# Altium schematic sheet BLDC_Drive.SchDoc
size A3; SheetNumber: 1; SheetTotal: 3
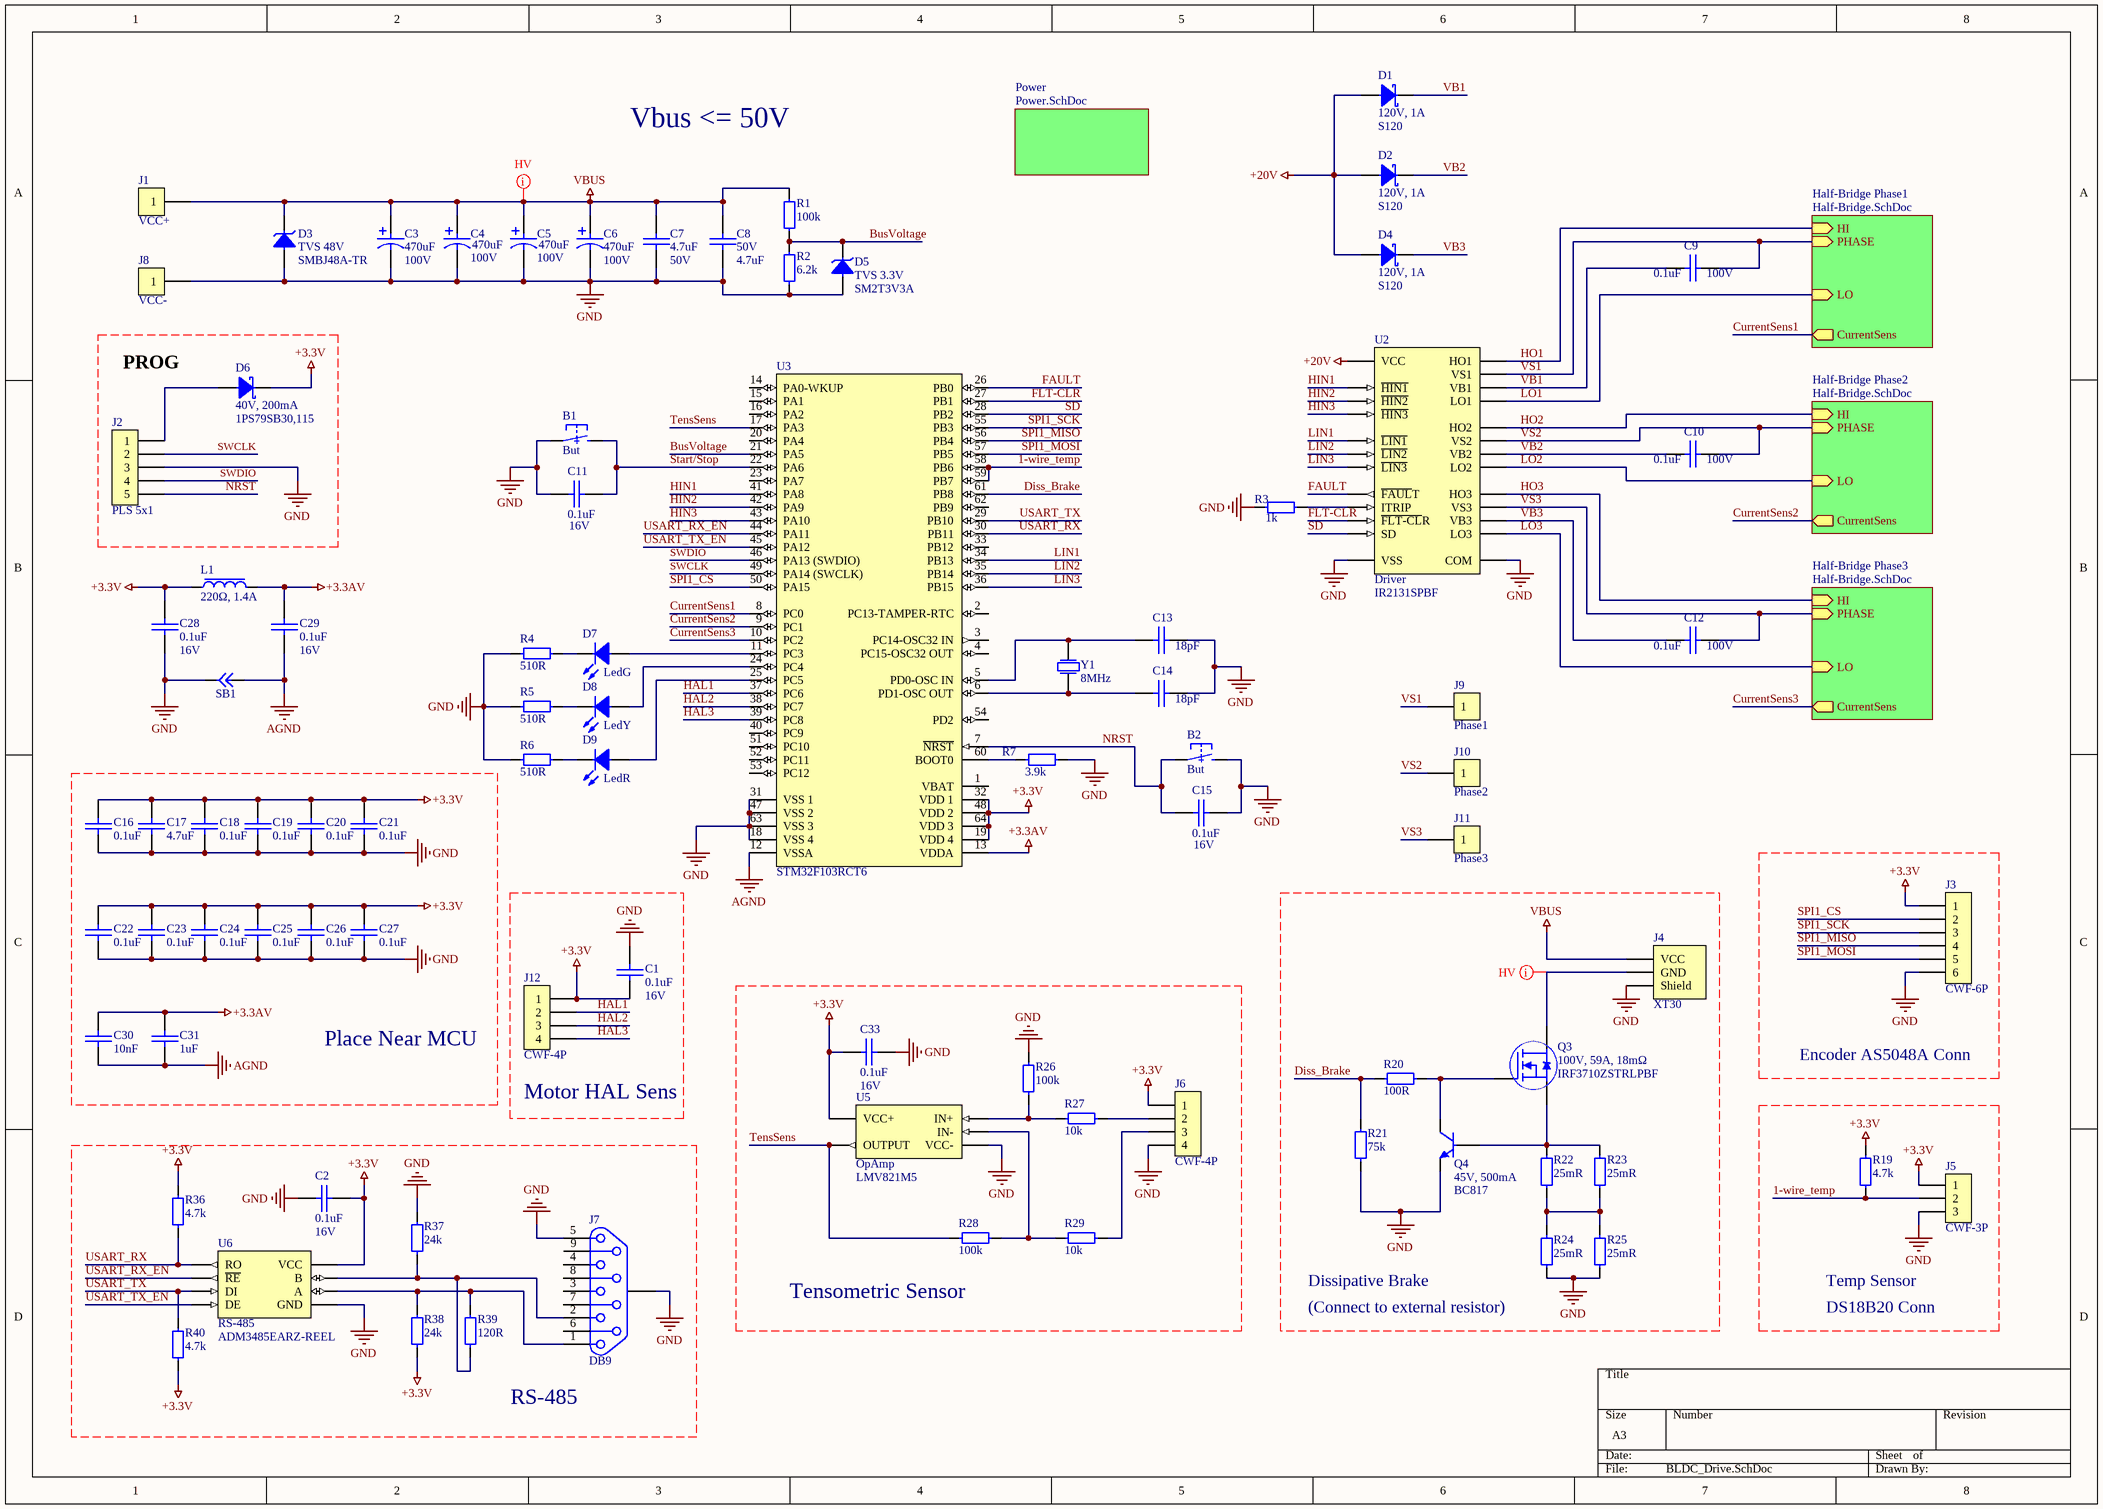
[diagram p0: BLDC_Drive.SchDoc]

## Parts
B1  But  [BUTTON 6x3.5]
B2  But  [BUTTON 6x3.5]
C1  0.1uF  Voltage: 16V  [0603 Capicator]
C2  0.1uF  Voltage: 16V  [0603 Capicator]
C3  470uF  Voltage: 100V  [ECAP 16x25mm]
C4  470uF  Voltage: 100V  [ECAP 16x25mm]
C5  470uF  Voltage: 100V  [ECAP 16x25mm]
C6  470uF  Voltage: 100V  [ECAP 16x25mm]
C7  4.7uF  Voltage: 50V  [1206 Capacitor]
C8  4.7uF  Voltage: 50V  [1206 Capacitor]
C9  0.1uF  Voltage: 100V  [1206 Capacitor]
C10  0.1uF  Voltage: 100V  [1206 Capacitor]
C11  0.1uF  Voltage: 16V  [0603 Capicator]
C12  0.1uF  Voltage: 100V  [1206 Capacitor]
C13  18pF  [0603 Capicator]
C14  18pF  [0603 Capicator]
C15  0.1uF  Voltage: 16V  [0603 Capicator]
C16  0.1uF  [0603 Capicator]
C17  4.7uF  [0603 Capicator]
C18  0.1uF  [0603 Capicator]
C19  0.1uF  [0603 Capicator]
C20  0.1uF  [0603 Capicator]
C21  0.1uF  [0603 Capicator]
C22  0.1uF  [0603 Capicator]
C23  0.1uF  [0603 Capicator]
C24  0.1uF  [0603 Capicator]
C25  0.1uF  [0603 Capicator]
C26  0.1uF  [0603 Capicator]
C27  0.1uF  [0603 Capicator]
C28  0.1uF  Voltage: 16V  [0603 Capicator]
C29  0.1uF  Voltage: 16V  [0603 Capicator]
C30  10nF  [0603 Capicator]
C31  1uF  [0603 Capicator]
C33  0.1uF  Voltage: 16V  [0603 Capicator]
D1  120V, 1A  Part Number: S120  [SOD-123FL]
D2  120V, 1A  Part Number: S120  [SOD-123FL]
D3  TVS 48V  Part Number: SMBJ48A-TR  [SMB]
D4  120V, 1A  Part Number: S120  [SOD-123FL]
D5  TVS 3.3V  Part Number: SM2T3V3A  [DO-216AA]
D6  40V, 200mA  Part Number: 1PS79SB30,115  [SOD-523]
D7  LedG  [0805 LED]
D8  LedY  [0805 LED]
D9  LedR  [0805 LED]
J1  VCC+  [Cable25]
J2  PLS 5x1  [PLS 5x1]
J3  CWF-6P  [Conn6x1]
J4  XT30  [HEADER 2 XT30PW Male]
J5  CWF-3P  [Conn3x1]
J6  CWF-4P  [Conn4x1]
J7  DB9  [DB9]
J8  VCC-  [Cable25]
J9  Phase1  [Cable25]
J10  Phase2  [Cable25]
J11  Phase3  [Cable25]
J12  CWF-4P  [Conn4x1]
L1  220Ω, 1.4A  [0603 Inductor]
Q3  100V, 59A, 18mΩ  Part Number: IRF3710ZSTRLPBF  [D2-PAK (TO-262)]
Q4  45V, 500mA  Part Number: BC817  [SOT-23]
R1  100k  [0603 Resistor]
R2  6.2k  [0603 Resistor]
R3  1k  [0603 Resistor]
R4  510R  [0603 Resistor]
R5  510R  [0603 Resistor]
R6  510R  [0603 Resistor]
R7  3.9k  [0603 Resistor]
R19  4.7k  [0603 Resistor]
R20  100R  [0603 Resistor]
R21  75k  [0603 Resistor]
R22  25mR  [2512 Resistor]
R23  25mR  [2512 Resistor]
R24  25mR  [2512 Resistor]
R25  25mR  [2512 Resistor]
R26  100k  [0603 Resistor]
R27  10k  [0603 Resistor]
R28  100k  [0603 Resistor]
R29  10k  [0603 Resistor]
R36  4.7k  [0603 Resistor]
R37  24k  [0603 Resistor]
R38  24k  [0603 Resistor]
R39  120R  [0603 Resistor]
R40  4.7k  [0603 Resistor]
SB1  Circuit Breaker  [SB 0603]  (value not drawn)
U2  Driver  Part Number: IR2131SPBF  [SOIC-28 Wide]
U3  STM32F103RCT6  [LQFP64]
U5  OpAmp  Part Number: LMV821M5  [SOT-23-5]
U6  RS-485  Part Number: ADM3485EARZ-REEL  [SOIC-8]
Y1  8MHz  [hc-49sm]

## Sub-sheets
Half-Bridge Phase1 = Half-Bridge.SchDoc: LO (in), HI (in), CurrentSens (out), PHASE (in)
Half-Bridge Phase2 = Half-Bridge.SchDoc: LO (in), HI (in), CurrentSens (out), PHASE (in)
Half-Bridge Phase3 = Half-Bridge.SchDoc: LO (in), HI (in), CurrentSens (out), PHASE (in)
Power = Power.SchDoc: no entries

## Nets
+3.3AV: C29.2 C30.2 C31.2 L1.2 U3.13(VDDA)
+3.3V: C1.1 C2.2 C16.2 C17.2 C18.2 C19.1 C20.2 C21.1 C22.2 C23.2 C24.2 C25.2 C26.2 C27.2 C28.2 C33.1 D6.2 J3.1 J5.1 J6.1 J12.1 L1.1 R19.2 R36.2 R38.1 R40.1 U3.19(VDD_4) U3.32(VDD_1) U3.48(VDD_2) U3.64(VDD_3) U5.5(VCC+) U6.8(VCC)
+20V: D1.1 D2.1 D4.1 U2.1(VCC)
AGND: C29.1 C30.1 C31.1 SB1.2 U3.12(VSSA)
GND: B1.1 B2.2 C1.2 C2.1 C3.1 C4.1 C5.1 C6.1 C7.1 C8.1 C11.1 C13.2 C14.2 C15.2 C16.1 C17.1 C18.1 C19.2 C20.1 C21.2 C22.1 C23.1 C24.1 C25.1 C26.1 C27.1 C28.1 C33.2 D3.1 D5.1 J2.3 J3.6 J4.A(Shield) J5.3 J6.4 J7.5 J7.A J8.1 Q4.2 R2.1 R3.1 R4.1 R5.1 R6.1 R7.2 R21.1 R24.1 R25.1 R26.1 R37.2 SB1.1 U2.12(VSS) U2.13(COM) U3.18(VSS_4) U3.31(VSS_1) U3.47(VSS_2) U3.63(VSS_3) U5.2(VCC-) U6.5(GND)
VBUS: C3.2 C4.2 C5.2 C6.2 C7.2 C8.2 D3.2 J1.1 J4.1(VCC) R1.2
1-wire_temp: J5.2 R19.1 U3.58(PB6) U3.59(PB7)
BusVoltage: D5.2 R1.1 R2.2 U3.21(PA5)
CurrentSens1: U3.8(PC0) ; sheet Half-Bridge Phase1/CurrentSens
CurrentSens2: U3.9(PC1) ; sheet Half-Bridge Phase2/CurrentSens
CurrentSens3: U3.10(PC2) ; sheet Half-Bridge Phase3/CurrentSens
Diss_Brake: R20.1 R21.2 U3.61(PB8)
FAULT: U2.8(~{FAUL}T) U3.26(PB0)
FLT-CLR: U2.10(~{FLT-CL}R) U3.27(PB1)
HAL1: J12.2 U3.37(PC6)
HAL2: J12.3 U3.38(PC7)
HAL3: J12.4 U3.39(PC8)
HIN1: U2.2(~{HIN1}) U3.41(PA8)
HIN2: U2.3(~{HIN2}) U3.42(PA9)
HIN3: U2.4(~{HIN3}) U3.43(PA10)
HO1: U2.27(HO1) ; sheet Half-Bridge Phase1/HI
HO2: U2.23(HO2) ; sheet Half-Bridge Phase2/HI
HO3: U2.19(HO3) ; sheet Half-Bridge Phase3/HI
LIN1: U2.5(~{LIN1}) U3.34(PB13)
LIN2: U2.6(~{LIN2}) U3.35(PB14)
LIN3: U2.7(~{LIN3}) U3.36(PB15)
LO1: U2.16(LO1) ; sheet Half-Bridge Phase1/LO
LO2: U2.15(LO2) ; sheet Half-Bridge Phase2/LO
LO3: U2.14(LO3) ; sheet Half-Bridge Phase3/LO
NRST: B2.1 C15.1 J2.5 U3.7(~{NRST})
SD: U2.11(SD) U3.28(PB2)
SPI1_CS: J3.2 U3.50(PA15)
SPI1_MISO: J3.4 U3.56(PB4)
SPI1_MOSI: J3.5 U3.57(PB5)
SPI1_SCK: J3.3 U3.55(PB3)
Start/Stop: B1.2 C11.2 U3.22(PA6)
SWCLK: J2.2 U3.49(PA14_(SWCLK))
SWDIO: J2.4 U3.46(PA13_(SWDIO))
TensSens: R28.2 U3.17(PA3) U5.4(OUTPUT)
USART_RX: R36.1 U3.30(PB11) U6.1(RO)
USART_RX_EN: U3.44(PA11) U6.2(~{RE})
USART_TX: R40.2 U3.29(PB10) U6.4(DI)
USART_TX_EN: U3.45(PA12) U6.3(DE)
VB1: C9.2 D1.2 U2.28(VB1)
VB2: C10.2 D2.2 U2.24(VB2)
VB3: C12.2 D4.2 U2.20(VB3)
VS1: C9.1 J9.1 U2.26(VS1) ; sheet Half-Bridge Phase1/PHASE
VS2: C10.1 J10.1 U2.22(VS2) ; sheet Half-Bridge Phase2/PHASE
VS3: C12.1 J11.1 U2.18(VS3) ; sheet Half-Bridge Phase3/PHASE
NetC13_1: C13.1 U3.5(PD0-OSC_IN) Y1.2
NetC14_1: C14.1 U3.6(PD1-OSC_OUT) Y1.1
NetD6_1: D6.1 J2.1
NetD7_1: D7.1 U3.11(PC3)
NetD7_2: D7.2 R4.2
NetD8_1: D8.1 U3.24(PC4)
NetD8_2: D8.2 R5.2
NetD9_1: D9.1 U3.25(PC5)
NetD9_2: D9.2 R6.2
NetJ4_2: J4.2(GND) Q3.2(Drain)
NetJ6_2: J6.2 R27.2
NetJ6_3: J6.3 R29.2
NetJ7_1: J7.1 R38.2 R39.2 U6.6(A)
NetJ7_2: J7.2 R37.1 R39.1 U6.7(B)
NetQ3_1: Q3.1(Gate) Q4.3 R20.2
NetQ3_3: Q3.3(Source) Q4.1 R22.2 R23.2
NetR3_2: R3.2 U2.9(ITRIP)
NetR7_1: R7.1 U3.60(BOOT0)
NetR22_1: R22.1 R23.1 R24.2 R25.2
NetR26_2: R26.2 R27.1 U5.1(IN+)
NetR28_1: R28.1 R29.1 U5.3(IN-)

Not connected (* = marked no-connect by the designer): J7 3 4 6 7 8 9; U3 1(VBAT) 2(PC13-TAMPER-RTC) 3(PC14-OSC32_IN) 4(PC15-OSC32_OUT) 14(PA0-WKUP) 15(PA1) 16(PA2) 20(PA4) 23(PA7) 33(PB12) 40(PC9) 51(PC10) 52(PC11) 53(PC12) 54(PD2) 62(PB9)

## Layout directives
net class HV: NetJ4_2, VBUS

## Notes on the sheet
- Vbus <= 50V
- PROG
- Place Near MCU
- (near J12) Motor HAL Sens
- Encoder AS5048A Conn
- (near R28) Tensometric Sensor
- Dissipative Brake
- (Connect to external resistor)
- Temp Sensor
- DS18B20 Conn
- RS-485

## Library data of the parts
B1 B2 = Button 2 Conn: Button 2 Conn SMD; Part Number: L-KLS7-TS3608-5.0-180; Manufacturer: KLS electronic co ltd; Type: Button; ComponentLink1Description: Chip&Dip; ComponentLink1URL: https://www.chipdip.ru/product/kls7-ts3608-5.0-180-td-02xa
C1 C2 C11 C15 C16 C18-C29 C33 = Cap 0.1uF (0603): 0.1uF X7R 16V 10% 0603; Manufacturer: Murata Manufacturing; Part Number: GRM188R71C104KA01D; Type: Capacitor; ComponentLink1Description: Chip&Dip; ComponentLink1URL: https://www.chipdip.ru/product/grm188r71c104ka01d
  C16 C18-C27: Voltage: 16V
C3-C6 = Cap Pol 470uF (100V): ECAP, 100V, 105°C, 20%, 8x16mm; Part Number: JRB2A471M07501600250000B; Manufacturer: JB; Type: Capacitor; ComponentLink1Description: Chip&Dip; ComponentLink1URL: https://www.chipdip.ru/product0/9000565913
C7 C8 = Cap 4.7uF (1206): 4.7uF X7R 10% 50V 1206; Manufacturer: Murata Manufacturing; Part Number: GRM31CR71H475KA12L; Type: Capacitor; ComponentLink1Description: Chip&Dip; ComponentLink1URL: https://www.chipdip.ru/product/grm31cr71h475ka12l
C9 C10 C12 = Cap 0.1uF (1206): 0.1uF X7R 100V 10% 1206; Manufacturer: Murata Manufacturing; Part Number: GRM319R72A104KA01D; Type: Capacitor; ComponentLink1Description: Chip&Dip; ComponentLink1URL: https://www.chipdip.ru/product0/9000697437
C13 C14 = Cap 18pF (0603): 18pF NP0 50V 5% 0603; Manufacturer: Murata Manufacturing; Part Number: GRM1885C1H180JA01D; Type: Capacitor; ComponentLink1Description: Chip&Dip; ComponentLink1URL: https://www.chipdip.ru/product/grm1885c1h180j; Voltage: 50V
C17 = Cap 4.7uF (0603): 4.7uF X5R 25V 10% 0603; Manufacturer: Murata Manufacturing; Part Number: GRM188R61E475KE11D; Type: Capacitor; ComponentLink1Description: Chip&Dip; ComponentLink1URL: https://www.chipdip.ru/product0/9000348448; Voltage: 25V
C30 = Cap 10nF (0603): X7R 10nF 100V 10% 0603; Manufacturer: Murata Manufacturing; Part Number: GRM188R72A103KA01D; Type: Capacitor; ComponentLink1Description: Chip&Dip; ComponentLink1URL: https://www.chipdip.ru/product/grm188r72a103ka01d; Voltage: 100V
C31 = Cap 1uF (0603): 1uF X5R 25V 10% 0603; Manufacturer: Murata Manufacturing; Part Number: GRM188R61E105KAADD; Type: Capacitor; ComponentLink1Description: Chip&Dip; ComponentLink1URL: https://www.chipdip.ru/product/grm188r61e105k; Voltage: 25V
D1 D2 D4 = Diode Schottky 120V (SOD-123FL): Manufacturer: Yangzhou Yangjie Electronic Technology Co; Type: Diode; ComponentLink1Description: DataSheet; ComponentLink1URL: https://static.chipdip.ru/lib/152/DOC001152954.pdf; ComponentLink2Description: Chip&Dip; ComponentLink2URL: https://www.chipdip.ru/product/s120
D3 = TVS Diode 48V [SMBJ]: 600W; Manufacturer: STMicroelectronics; Type: Diode; ComponentLink1Description: DataSheet; ComponentLink1URL: https://static.chipdip.ru/lib/252/DOC011252020.pdf; ComponentLink2Description: Chip&Dip; ComponentLink2URL: https://www.chipdip.ru/product/smbj48a
D5 = TVS Diode 3.3V [SM2T]: High peak pulse power: 200 W (10/1000 μs); Manufacturer: STMicroelectronics; Type: Diode; ComponentLink1Description: DataSheet; ComponentLink1URL: https://www.st.com/resource/en/datasheet/sm2t3v3a.pdf; ComponentLink2Description: Chip&Dip; ComponentLink2URL: https://www.chipdip.ru/product0/8283670575
D6 = Diode Schottky (SOD-523): Schottky Barrier Diodes, 200mA to 500mA; Manufacturer: Nexperia; Type: Diode; ComponentLink1Description: DataSheet; ComponentLink1URL: https://static.chipdip.ru/lib/583/DOC001583065.pdf; ComponentLink2Description: Chip&Dip; ComponentLink2URL: https://www.chipdip.ru/product/1ps79sb30.115
D7 = Led Green: Led Green SMD 1608, 120°, 525nM; Part Number: TO-1608BC-PG; Manufacturer: Taiwan Oasis Technology; Type: Diode; ComponentLink1Description: Chip&Dip; ComponentLink1URL: https://www.chipdip.ru/product/to-1608bc-pg
D8 = Led Yellow: SMD 1608, 247mcd, 120°, 592nM (High Bright Yellow); Part Number: TO-1608BC-MYF; Manufacturer: Taiwan Oasis Technology; Type: Diode; ComponentLink1Description: Chip&Dip; ComponentLink1URL: https://www.chipdip.ru/product/to-1608bc-myf
D9 = Led Red: SMD 1608, 112mcd, 120°, 630nM (Ultra Bright Red); Part Number: TO-1608BC-MRE; Manufacturer: Taiwan Oasis Technology; Type: Diode; ComponentLink1Description: Chip&Dip; ComponentLink1URL: https://www.chipdip.ru/product/to-1608bc-mre
J1 J8-J11 = Conn 1 [Cable]
J2 = Conn 5 (PLS): Header, 5-Pin
J3 = Conn 6 [CWF]: Right-Angle; Manufacturer: Ningbo connfly electronic (Zhenqin); Part Number: DS1069-6MRW6X-B; Type: Connector; ComponentLink1Description: Chip&Dip; ComponentLink1URL: https://www.chipdip.ru/product/cwf-6r
J4 = Connector XT30PW-Male: Standart RC Connector; Part Number: XT30PW; Manufacturer: Amass; ComponentLink1Description: AliExpress; ComponentLink1URL: https://ru.aliexpress.com/item/4000070113352.html?spm=a2g0o.productlist.0.0.39dd34bfyYuspa&algo_pvid=4d7d83f5-6270-4220-b100-9b5f13b0846d&algo_expid=4d7d83f5-6270-4220-b100-9b5f13b0846d-3&btsid=c67bc929-e3be-4af3-9fd9-25ac13ce4818&ws_ab_test=searchweb0_0,searchweb201602_,searchweb201603_55; Type: Connector
J5 = Conn 3 [CWF]: Right-Angle; Manufacturer: Ningbo connfly electronic (Zhenqin); Part Number: DS1069-3MRW6SA; Type: Connector; ComponentLink1Description: Chip&Dip; ComponentLink1URL: https://www.chipdip.ru/product/cwf-3r
J6 J12 = Conn 4 [CWF]: Right-Angle; Part Number: DS1069-4MRW6XB; Manufacturer: Ningbo connfly electronic (Zhenqin); Type: Connector; ComponentLink1Description: Chip&Dip; ComponentLink1URL: https://www.chipdip.ru/product/cwf-4r
J7 = Connector DB9: CONN D-SUB PLUG 9POS R/A SOLDER; Part Number: DR09S-H-CN; Manufacturer: Auk Contractors; ComponentLink1Description: DataSheet; ComponentLink1URL: https://static.chipdip.ru/lib/009/DOC004009535.pdf; ComponentLink2Description: Chip&Dip; ComponentLink2URL: https://www.chipdip.ru/product/dr09s-h-cn-drb-9fa-dbr-9f; Type: Connector
L1 = Ferrite Bead 220 (0603): Chip beads for power line. GHz noise countermeasure; Part Number: BLM18PG221SN1D; Manufacturer: Murata; Type: Inductor; ComponentLink1Description: DataSheet; ComponentLink1URL: https://product.tdk.com/en/system/files?file=dam/doc/product/emc/emc/beads/catalog/beads_commercial_power_mpz1005-e_en.pdf; ComponentLink2Description: Electronshik; ComponentLink2URL: https://www.electronshik.ru/item/MUR/BLM18PG221SN1D; ComponentLink3Description: Chip&Dip; ComponentLink3URL: https://www.chipdip.ru/product0/8007351955
Q3 = MOSFET-N [IRF]: Power MOSFET utilizes the latest processing techniques to achieve extremely low on-resistance per silicon area; Manufacturer: Infineon; Type: Transistor; ComponentLink1Description: DataSheet; ComponentLink1URL: https://static.chipdip.ru/lib/300/DOC000300442.pdf; ComponentLink2Description: Chip&Dip; ComponentLink2URL: https://www.chipdip.ru/product/irf3710zspbf
Q4 = NPN [BC817]: NPN general-purpose transistors; Manufacturer: Nexperia; Type: Transistor; ComponentLink1Description: DataSheet; ComponentLink1URL: https://static.chipdip.ru/lib/156/DOC000156781.pdf; ComponentLink2Description: Chip&Dip; ComponentLink2URL: https://www.chipdip.ru/product/bc817-40
R1 R26 R28 = Res 100k (0603): 0.1W 0603 100k, 1%; Part Number: RC0603FR-07100KL; Manufacturer: Taiwan; Type: Resistor; ComponentLink1Description: Chip&Dip; ComponentLink1URL: https://www.chipdip.ru/product0/9000079760
R2 = Res 6.2k (0603): 0.1W 0603 6.2k, 1%; Part Number: RC0603FR-076K2L; Manufacturer: Taiwan; Type: Resistor; ComponentLink1Description: Chip&Dip; ComponentLink1URL: https://www.chipdip.ru/product/0.1w-0603-6.2-kom-1
R3 = Res 1k (0603): 0.1W 0603 1k, 1%; Part Number: RC0603FR-071KL; Manufacturer: Taiwan; Type: Resistor; ComponentLink1Description: Chip&Dip; ComponentLink1URL: https://www.chipdip.ru/product0/9000079676
R4-R6 = Res 510R (0603): 0.1W 0603 510R, 1%; Part Number: RC0603FR-07510RL; Manufacturer: Taiwan; Type: Resistor; ComponentLink1Description: Chip&Dip; ComponentLink1URL: https://www.chipdip.ru/product0/9000079669
R7 = Res 3.9k (0603): 0.1W 0603 3.9k, 1%; Part Number: RC0603FR-073K9L; Manufacturer: Taiwan; Type: Resistor; ComponentLink1Description: Chip&Dip; ComponentLink1URL: https://www.chipdip.ru/product0/9000079726
R19 R36 R40 = Res 4.7k (0603): 0.1W 0603 4.7k, 1%; Part Number: RC0603FR-074K7L; Manufacturer: Taiwan; Type: Resistor; ComponentLink1Description: Chip&Dip; ComponentLink1URL: https://www.chipdip.ru/product0/9000079728
R20 = Res 100R (0603): 0.1W 0603 100R, 1%; Part Number: RC0603FR-07100RL; Manufacturer: Taiwan; Type: Resistor; ComponentLink1Description: Chip&Dip; ComponentLink1URL: https://www.chipdip.ru/product0/9000079616
R21 = Res 75k (0603): 0.1W 0603 75k, 1%; Part Number: RC0603FR-0775KL; Manufacturer: Taiwan; Type: Resistor; ComponentLink1Description: Chip&Dip; ComponentLink1URL: https://www.chipdip.ru/product0/9000079757
R22-R25 = Res 25mR (2512): 1W 2512 25mR, 1%; Part Number: WSL2512R0250FEA; Manufacturer: Vishay; Type: Resistor; ComponentLink1Description: Electronshik; ComponentLink1URL: https://www.electronshik.ru/item/VISHAY/WSL2512R0250FEA
R27 R29 = Res 10k (0603): 0.1W 0603 10k, 1%; Part Number: RC0603FR-0710KL; Manufacturer: Taiwan; Type: Resistor; ComponentLink1Description: Chip&Dip; ComponentLink1URL: https://www.chipdip.ru/product0/9000079736
R37 R38 = Res 24k (0603): 0.1W 0603 24k, 1%; Part Number: RC0603FR-0724KL; Manufacturer: Taiwan; Type: Resistor; ComponentLink1Description: Chip&Dip; ComponentLink1URL: https://www.chipdip.ru/product/0.1w-0603-24-kom-1
R39 = Res 120R (0603): 0.1W 0603 120R, 1%; Part Number: RC0603FR-07120RL; Manufacturer: Taiwan; Type: Resistor; ComponentLink1Description: Chip&Dip; ComponentLink1URL: https://www.chipdip.ru/product/0.1w-0603-120-om-1
U2 = MOSFET Driver 3 Channel: High voltage, high speed power / MOSFET and IGBT driver with three independent high / and low side referenced output channels; Manufacturer: Infineon; ComponentLink1Description: Electronshik; ComponentLink1URL: https://www.electronshik.ru/item/INFIN/IR2131SPBF; ComponentLink2Description: DataSheet; ComponentLink2URL: https://static.chipdip.ru/lib/300/DOC000300114.pdf; Type: IC; ComponentLink3Description: Chip&Dip; ComponentLink3URL: https://www.chipdip.ru/product/ir2131s
U3 = STM32F103RCT6: IC MCU 32BIT 256KB FLASH 64LQFP; Manufacturer: STMicroelectronics; Part Number: STM32F103RCT6; Type: IC; ComponentLink1Description: DataSheet; ComponentLink1URL: https://www.st.com/resource/en/datasheet/cd00191185.pdf; ComponentLink2Description: Chip&Dip; ComponentLink2URL: https://www.chipdip.ru/product/stm32f103rct6-2
U5 = OpAmp [LMV821]: A single low power precision Operational Amplifier intended for use in a wide range of applications; Manufacturer: Texas Instruments; ComponentLink1Description: DataSheet; ComponentLink1URL: https://static.chipdip.ru/lib/235/DOC000235297.pdf; ComponentLink2Description: Chip&Dip; ComponentLink2URL: https://www.chipdip.ru/product/lmv821m5; Type: IC
U6 = RS-485 Transiever: The ADM3485E is a 3.3 V, low power data transceiver with ±15 kV ESD protection, suitable for half-duplex communication on multipoint bus transmission lines.; Manufacturer: Analog Devices; ComponentLink1Description: Chip&Dip; ComponentLink1URL: https://www.chipdip.ru/product0/8957213292; ComponentLink2Description: DataSheet; ComponentLink2URL: https://static.chipdip.ru/lib/154/DOC013154525.pdf; Type: IC
Y1 = Crystal 8MHz SMD: Crystal. HC-49SM (US); Manufacturer: China; Part Number: 8.000MHzHC-49SM; Type: Crystal; ComponentLink1Description: Chip&Dip; ComponentLink1URL: https://www.chipdip.ru/product/8mhz-hc-49sm